# Altium schematic sheet PID.SchDoc
size A; SheetNumber: 3; SheetTotal: 6
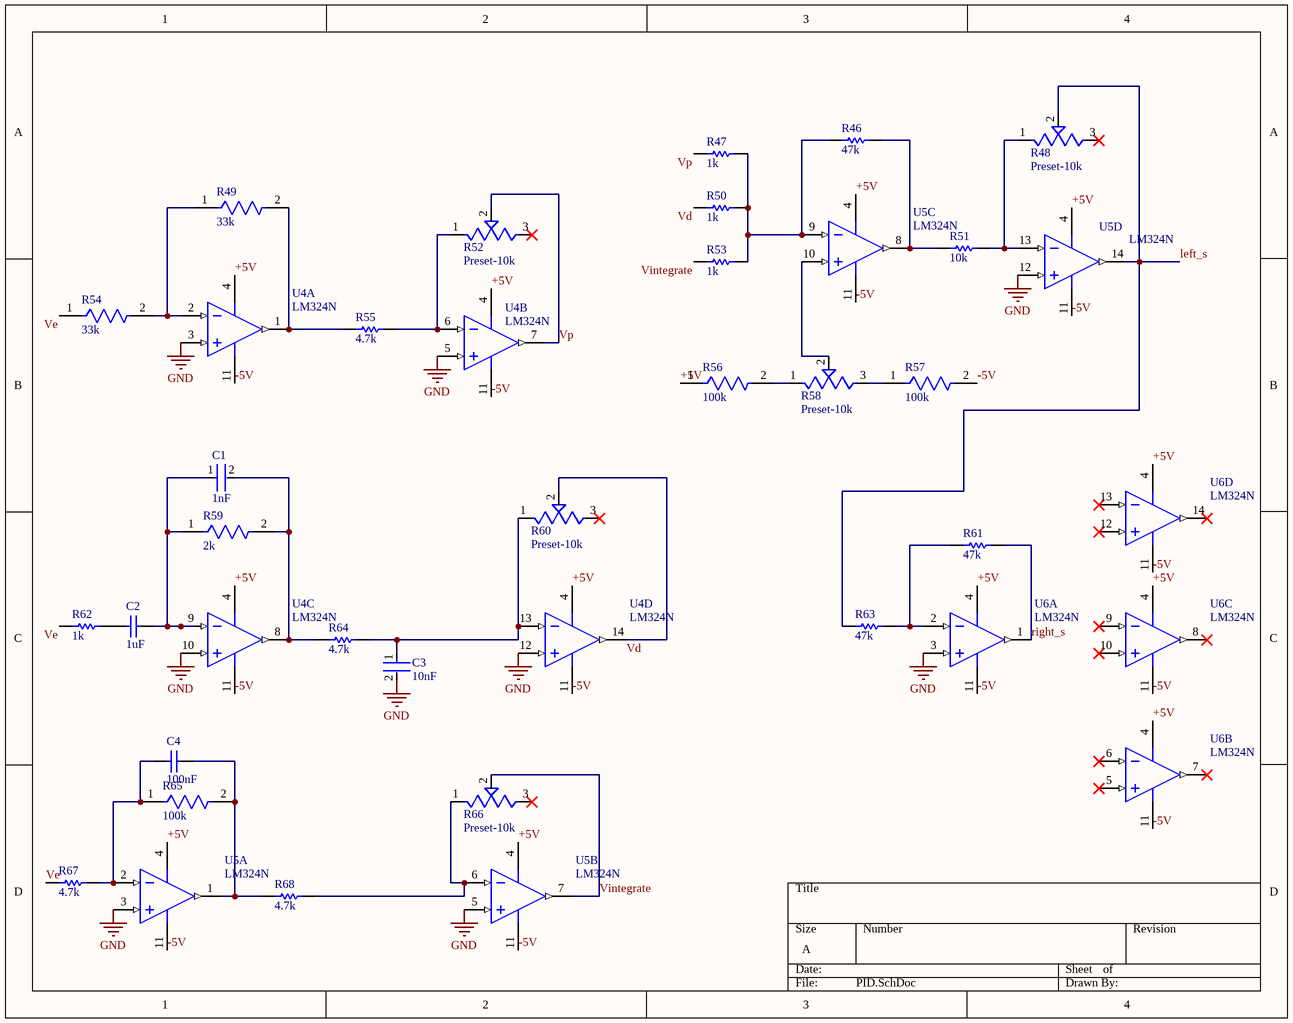
[diagram p0: PID.SchDoc]

## Parts
C1  1nF  [FP-CL21-IPC_B]
C2  1uF  [CAPC2013X135X45ML10T25]
C3  10nF  [FP-C0805C-DN-MFG]
C4  100nF  [CAPC2013X135X45ML10T25]
R46  47k  [RESC2013X60X35NL10T20]
R47  1k  [RESC2013X60X35ML10T20]
R48  Preset-10k  [TRIM_3306F-1-103]
R49  33k  [FP-CRCW0805-e3-IPC_B]
R50  1k  [RESC2013X60X35ML10T20]
R51  10k  [RESC2013X60X35NL10T20]
R52  Preset-10k  [TRIM_3306F-1-103]
R53  1k  [RESC2013X60X35ML10T20]
R54  33k  [FP-CRCW0805-e3-IPC_B]
R55  4.7k  [YAGO-RC0805_M]
R56  100k  [FP-RC0805-0_6-IPC_C]
R57  100k  [FP-RC0805-0_6-IPC_C]
R58  Preset-10k  [TRIM_3306F-1-103]
R59  2k  [FP-CRCW0805-e3-IPC_B]
R60  Preset-10k  [TRIM_3306F-1-103]
R61  47k  [RESC2013X60X35NL10T20]
R62  1k  [RESC2013X60X35ML10T20]
R63  47k  [RESC2013X60X35NL10T20]
R64  4.7k  [YAGO-RC0805_M]
R65  100k  [FP-RC0805-0_6-IPC_C]
R66  Preset-10k  [TRIM_3306F-1-103]
R67  4.7k  [YAGO-RC0805_M]
R68  4.7k  [YAGO-RC0805_M]
U4  LM324N  [N0014A]  (parts A,B,C,D of 4)
U5  LM324N  [N0014A]  (parts A,B,C,D of 4)
U6  LM324N  [N0014A]  (parts A,B,C,D of 4)

## Nets
GND: C3.2 U4.3(IN1+) U4.5(IN2+) U4.10(IN3+) U4.12(IN4+) U5.3(IN1+) U5.5(IN2+) U5.12(IN4+) U6.3(IN1+)
+5V: R56.1 U4.4(V+) U5.4(V+) U6.4(V+)
-5V: R57.2 U4.11(GND) U5.11(GND) U6.11(GND)
left_s: R48.2(W) R63.1 U5.14(OUT4)
right_s: R61.2 U6.1(OUT1)
Vd: R50.1 R60.2(W) U4.14(OUT4)
Ve: R54.1 R62.1 R67.1
Vintegrate: R53.1 R66.2(W) U5.7(OUT2)
Vp: R47.1 R52.2(W) U4.7(OUT2)
NetC1_1: C1.1 C2.2 R59.1 U4.9(IN3-)
NetC1_2: C1.2 R59.2 R64.1 U4.8(OUT3)
NetC2_1: C2.1 R62.2
NetC3_1: C3.1 R60.1(CCW) R64.2 U4.13(IN4-)
NetC4_1: C4.1 R65.1 R67.2 U5.2(IN1-)
NetC4_2: C4.2 R65.2 R68.1 U5.1(OUT1)
NetR46_1: R46.1 R47.2 R50.2 R53.2 U5.9(IN3-)
NetR46_2: R46.2 R51.1 U5.8(OUT3)
NetR48_1: R48.1(CCW) R51.2 U5.13(IN4-)
NetR49_1: R49.1 R54.2 U4.2(IN1-)
NetR49_2: R49.2 R55.1 U4.1(OUT1)
NetR52_1: R52.1(CCW) R55.2 U4.6(IN2-)
NetR56_2: R56.2 R58.1(CCW)
NetR57_1: R57.1 R58.3(CW)
NetR58_2: R58.2(W) U5.10(IN3+)
NetR61_1: R61.1 R63.2 U6.2(IN1-)
NetR66_1: R66.1(CCW) R68.2 U5.6(IN2-)

Not connected (* = marked no-connect by the designer): R48 3(CW)*; R52 3(CW)*; R60 3(CW)*; R66 3(CW)*; U6 5(IN2+)* 6(IN2-)* 7(OUT2)* 8(OUT3)* 9(IN3-)* 10(IN3+)* 12(IN4+)* 13(IN4-)* 14(OUT4)*

## Library data of the parts
C1 = 1nF: CL21 Series 0805 1nF 50V ±10% Tolerance X7R Multilayer Ceramic Chip Capacitor; CL21B102KBANNNC; Contact Plating: Tin; Tolerance: 10%; Package Quantity: 4000; Voltage: 50V; Mount: Surface Mount; Material: Ceramic; Width: 0.049inch; Capacitance: 1nF; Case Code (Metric): 2012; Case Code (Imperial): 0805; Height: 0.65mm; Max Operating Temperature: 125°C; Thickness: 0.03inch; Length: 2mm; Radiation Hardening: No; Depth: 1.25mm; Packaging: Tape and Reel; Voltage Rating: 50V; Dielectric: X7R; Min Operating Temperature: -55°C; Case/Package: 0805
C2 = 1uF: Multilayer Ceramic Capacitor, 1 uF, +/- 10%, 16 V, -55 to 125 degC, 0805 (2012 Metric), RoHS, Tape and Reel; GRM21BR71C105KA01L; Manufacturer: Murata; Dielectric: X7R; Capacitance: 1µF; Rated Voltage: 16V; Package Description: 2-Pin Surface Mount Device, Body 2 x 1.25 mm; Datasheet Version: Mar-08; Package Reference: 805; Datasheet URL: https://datasheet.ciiva.com/34302/1858922-34302874.pdf; Case Size/Dimension: 0805; Tolerance (%): ±10%; Manufacturer URL: http://www.murata.com/
C3 = 10nF: CAP CER 10000PF 50V X7R 0805; C0805C103K5RACTU; Manufacturer: KEMET; Capacitance: 10,000 pF; Material: Ceramic; Tolerance: 0.1; Value: 10,000 pF; Temperature Coefficient: 30ppm/°C; Temperature: -55°C to +125°C; Device Class L3: Ceramic Capacitors; ComponentLink2URL: https://content.kemet.com/datasheets/KEM_C1003_C0G_SMD.pdf; Temperature Range Low: -55°C; Manufacturer Part Number: C0805C103K5RACTU; Ipc Land Pattern Name: CAPC200125X78; Height: 0.88mm; Temperature Range High: +125°C; Category: Cap; ComponentLink2Description: Datasheet; Octopart: https://octopart.com/c0805c103k5ractu-kemet-90536; Package: C0805C-DN; Device Class L2: Capacitors; Voltage Rating: 50 V; RoHS: TRUE; Automotive: No; Digikey Description: CAP CER 10000PF 50V X7R 0805; Temperature Characteristic: X7R; Device Class L1: Passive Components; Lead Free: Yes
C4 = 100nF: Chip Capacitor, 0.1 uF, +/- 10%, 50 V, -55 to 125 degC, 0805 (2012 Metric), RoHS, Tape and Reel; GRM21BR71H104KA01L; Manufacturer: Murata; Voltage: 50V; Insulation Resistance: 10GR; Dielectric Material: Ceramic; Dielectric: X7R; Package Description: 2-Pin Surface Mount Device, Body 2 x 1.25 mm; Manufacturer URL: http://www.murata.com/; Case Code (Imperial): 0805; Capacitance: 100nF; Datasheet URL: http://psearch.en.murata.com/capacitor/product/GRM21BR71H104KA01%23.pdf; Termination: SMD/SMT; Lead Free: LeadFree; Package Quantity: 1; Mount: SurfaceMount; REACH SVHC: Unknown; Thickness: 0.053inch; Height: 1.25mm; Case/Package: 0805; Voltage Rating: 50V; Width: 0.049inch; Case Code (Metric): 2012; Material: Ceramic; Min Operating Temperature: -55degC; RoHSCompliant: true; Datasheet Version: 42675.0; Voltage Rating (DC): 50V; Tolerance: 10%; Package Reference: 0805; Depth: 1.25mm; Length: 2mm; Max Operating Temperature: 125degC; Packaging: TapeandReel; Number of Pins: 2; Radiation Hardening: No
R46 R61 R63 = 47k: Chip Resistor, 47 KOhm, +/- 1%, 0.125 W, -55 to 155 degC, 0805 (2012 Metric), RoHS, Tape and Reel; RC0805FR-0747KL; Manufacturer: Yageo; Voltage Rating: 150 V; Height: 0.5 mm; ComponentLink2URL: http://www.yageo.com/documents/recent/PYu-RC_Group_51_RoHS_L_04.pdf; ComponentLink2Description: Datasheet; Package Quantity: 200; Max Operating Temperature: 155 degC; Min Operating Temperature: -55 degC; Packaging: Tape and Reel; Pins: 2; PackageReference: 0805; Mounting Technology: Surface Mount; ComponentLink1Description: Manufacturer URL; ComponentLink1URL: http://www.yageo.com/; PackageDescription: 2-Pin Surface Mounted Device, Body 2 x 1.25 mm; Length: 2 mm; REACH SVHC: No SVHC; Mount: Surface Mount; RoHSCompliant: true; DatasheetVersion: Rev. 4, 02/2016
R47 R50 R53 R62 = 1k: Chip Resistor, 1 KOhm, +/- 1%, 125 mW, -55 to 155 degC, 0805 (2012 Metric), RoHS, Tape and Reel; RC0805FR-071KL; Manufacturer: Yageo; Temperature Coefficient: 100ppm/degreesC; Voltage Rating (DC): 150V; Max Power Dissipation: 125mW; Resistance: 1KOhm; Number of Pins: 2; Number of Terminations: 2; Datasheet URL: http://www.yageo.com/NewPortal/yageodocoutput?fileName=/pdf/R-Chip/PYu-RC_Group_51_RoHS_L_5.pdf; Length: 0.079inch; Package Description: 2-Pin Surface Mounted Device, Body 2 x 1.25 mm; Depth: 1.25mm; Height: 0.024inch; Military Standard: Not; Case/Package: 0805; Package Reference: 0805; RoHSCompliant: true; Lead Free: LeadFree; Packaging: TapeandReel; Package Quantity: 1; Datasheet Version: Rev. 5, 10/2016; Tolerance: 1%; Min Operating Temperature: -55degC; Voltage Rating: 150V; Composition: ThickFilm; Case Code (Imperial): 0805; Power Rating: 125mW; Width: 0.049inch; Case Code (Metric): 2012; Manufacturer URL: http://www.yageo.com/; Max Operating Temperature: 155degC; REACH SVHC: Unknown; Termination: SMD/SMT
R48 R52 R58 R60 R66 = Preset: TRIMMER - 6MM ROUND, SINGLE-TURN,CERMET, 10K OHMS | Bourns 3306F-1-103; SnapEDA_Link: https://www.snapeda.com/parts/3306F-1-103/Bourns/view-part/?ref=snap; Package: 3306F Bourns; Value: *; MF: Bourns; MP: 3306F-1-103; Check_prices: https://www.snapeda.com/parts/3306F-1-103/Bourns/view-part/?ref=eda
R49 R54 = 33k: RES Thick Film, 33kΩ, 1%, 0.125W, 100ppm/°C, 0805; CRCW080533K0FKEA; Power Rating: 125mW; Voltage Rating (DC): 150V; Resistance: 33kR; Radiation Hardening: No; Termination: SMD/SMT; Military Standard: Not; Packaging: Tape and Reel; Temperature Coefficient: 100ppm/°C; Lead Free: Lead Free; Max Power Dissipation: 125mW; Features: Automotive AEC-Q200; Composition: Thick Film; Voltage Rating: 150V; Package Quantity: 5000; Max Operating Temperature: 155°C; Weight: 0.000194oz; Case/Package: 0805; Case Code (Imperial): 0805; Length: 2mm; Height: 0.45mm; Min Operating Temperature: -55°C; Contact Plating: Tin; Case Code (Metric): 2012; Tolerance: 1%; Number of Terminations: 2; Width: 1.25mm; Depth: 1.25mm
R51 = 10k: Chip Resistor, 10 KOhm, +/- 1%, 0.125 W, -55 to 155 degC, 0805 (2012 Metric), RoHS, Tape and Reel; RC0805FR-0710KL; Manufacturer: Yageo; Voltage Rating: 150 V; Mount: Surface Mount; ComponentLink1Description: Manufacturer URL; ComponentLink2URL: http://www.yageo.com/documents/recent/PYu-RC_Group_51_RoHS_L_04.pdf; Pins: 2; Length: 2 mm; Min Operating Temperature: -55 degC; Height: 0.5 mm; Mounting Technology: Surface Mount; RoHSCompliant: true; REACH SVHC: No SVHC; ComponentLink1URL: http://www.yageo.com/; Max Operating Temperature: 155 degC; PackageReference: 0805; DatasheetVersion: Rev. 4, 02/2016; Package Quantity: 5000; Packaging: Tape and Reel; ComponentLink2Description: Datasheet; PackageDescription: 2-Pin Surface Mounted Device, Body 2 x 1.25 mm
R55 R64 R67 R68 = 4.7k: General Puprose Chip Resistor, 4700 Ohm +/- 1%, 0.125 W, -55 to 155 degC, 2-Pin SMD, RoHS, Tape and Reel; RC0805FR-074K7L; Tolerance: +/- 1%; Power: 0.125 W; PackageDescription: 2-Pin Surface Mount Device, Body 2 x 1.25 mm; ComponentLink2URL: http://www.yageo.com/documents/recent/PYu-RC_Group_51_RoHS_L-3.pdf; Temperature Min: -55 degC; Packing: Tape and Reel; Mounting Technology: Surface Mount; PartNumber: RC0805FR-074K7L; ComponentLink1URL: http://www.yageo.com/NewPortal/_en/index.jsp; Resistance: 4700 Ohm; Temperature Max: 155 degC; ComponentLink2Description: Datasheet; DatasheetVersion: Rev. 3; RoHS: TRUE; ComponentLink1Description: Manufacturer URL
R56 R57 R65 = 100k: RES 100K OHM 1% 1/8W 0805; RC0805FR-07100KL; Power Rating: 125mW; Temperature Coefficient: 100ppm/°C; Voltage Rating (DC): 150V; Resistance: 100kR; Package Quantity: 1; Case/Package: 0805; Lead Pitch: 0.4mm; Case Code (Imperial): 0805; Construction: Rectangular; Number of Terminations: 2; RoHS Compliant: Yes; Max Power Dissipation: 125mW; Tolerance: 1%; Max Operating Temperature: 155°C; Resistance Tolerance: 1%; Lead Free: Lead Free; Packaging: Tape and Reel; Resistor Type: Thick Film; Min Operating Temperature: -55°C; Case Code (Metric): 2012; Series: RC; Technology: THICK FILM; Voltage Rating: 150V; Termination: SMD/SMT; Width: 0.049inch; Number of Pins: 2; Features: Moisture Resistant; Military Standard: Not; Length: 0.079inch; Depth: 1.25mm; Size Code: 0805; Height: 0.024inch
R59 = 2k: RES Thick Film, 2kΩ, 1%, 0.125W, 100ppm/°C, 0805; CRCW08052K00FKEA; Working Voltage: 150V; Max Power Dissipation: 125mW; Resistance: 2kR; Package Quantity: 10; Case Code (Metric): 2012; Voltage Rating: 150V; Number of Terminations: 2; Max Operating Temperature: 155°C; Depth: 1.25mm; Tolerance: 1%; Power Rating: 125mW; Lead Free: Lead Free; Case/Package: 0805; Features: Automotive AEC-Q200; Min Operating Temperature: -55°C; Termination: SMD/SMT; Case Code (Imperial): 0805; Weight: 0.000194oz; Packaging: Tape and Reel; Military Standard: Not; Radiation Hardening: No; Contact Plating: Tin; Mount: Surface Mount; Temperature Coefficient: 100ppm/°C; Height: 0.02inch; Number of Terminals: 2; Voltage Rating (DC): 150V; Number of Pins: 2; Length: 2mm; Width: 1.25mm; Composition: Thick Film
U4-U6 = LM324N: Low Power Quad Operational Amplifier, 14-pin MDIP; Manufacturer: Texas Instruments; CompType: Amplifiers; PowerWise: N; PackageTopMarking: NSUZXYYTTE#*LM324N; PackageDescription: MDIP, .750 x .250 x.130in, 14 Lead, .100in Pitch; Package Reference: N0014A; RoHS: N; Code_JEDEC: MS-001-AA; ComponentLink1URL: http://www.ti.com/general/docs/lit/getliterature.tsp?genericPartNumber=LM324&fileType=pdf; ComponentLink1Description: Datasheet URL; PinCount: 14